# Altium schematic sheet Audio_Output_Line_Out.SchDoc: Audio Research: Line Out
size A4; DrawnBy: Connor Dack; Engineer: Connor Dack; DocumentNumber: 18; Revision: 1.0; SheetNumber: 18; SheetTotal: 20
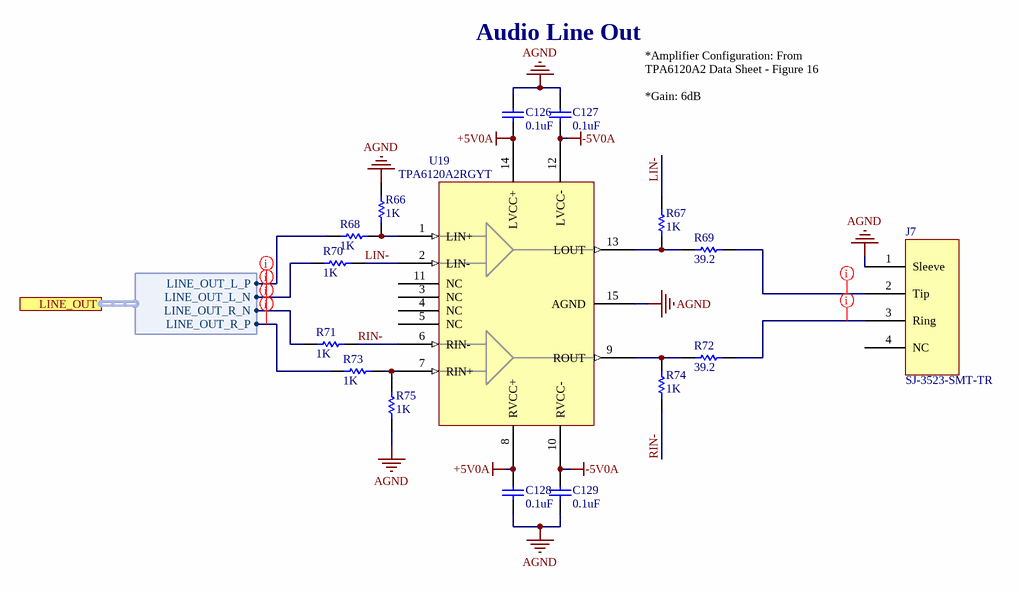
[diagram p0: Audio_Output_Line_Out.SchDoc]

## Parts
C126  Capacitance: 0.1uF  [3-0603_L]  (hidden comment: CL10F104ZO8NNNC)
C127  Capacitance: 0.1uF  [3-0603_L]  (hidden comment: CL10F104ZO8NNNC)
C128  Capacitance: 0.1uF  [3-0603_L]  (hidden comment: CL10F104ZO8NNNC)
C129  Capacitance: 0.1uF  [3-0603_L]  (hidden comment: CL10F104ZO8NNNC)
J7  SJ-3523-SMT-TR  [SJ-3523-SMT-TR]
R66  Resistance (Ohms): 1K  [3-0603_R_L]  (hidden comment: ERJ-3EKF1001V)
R67  Resistance (Ohms): 1K  [3-0603_R_L]  (hidden comment: ERJ-3EKF1001V)
R68  Resistance (Ohms): 1K  [3-0603_R_L]  (hidden comment: ERJ-3EKF1001V)
R69  Resistance (Ohms): 39.2  [3-0603_R_L]  (hidden comment: ERJ-3EKF39R2V)
R70  Resistance (Ohms): 1K  [3-0603_R_L]  (hidden comment: ERJ-3EKF1001V)
R71  Resistance (Ohms): 1K  [3-0603_R_L]  (hidden comment: ERJ-3EKF1001V)
R72  Resistance (Ohms): 39.2  [3-0603_R_L]  (hidden comment: ERJ-3EKF39R2V)
R73  Resistance (Ohms): 1K  [3-0603_R_L]  (hidden comment: ERJ-3EKF1001V)
R74  Resistance (Ohms): 1K  [3-0603_R_L]  (hidden comment: ERJ-3EKF1001V)
R75  Resistance (Ohms): 1K  [3-0603_R_L]  (hidden comment: ERJ-3EKF1001V)
U19  TPA6120A2RGYT  [PQFN50P350X350X100_HS-15N]

## Ports
LINE_OUT (harness LINE_OUT)

## Harnesses
LINE_OUT: LINE_OUT_L_N, LINE_OUT_L_P, LINE_OUT_R_N, LINE_OUT_R_P

## Nets
+5V0A: C126.2 C128.1 U19.8(RVCC+) U19.14(LVCC+)
-5V0A: C127.2 C129.1 U19.10(RVCC-) U19.12(LVCC-)
AGND: C126.1 C127.1 C128.2 C129.2 J7.1(Sleeve) R66.2 R75.1 U19.15(AGND)
LIN-: R67.1 R70.2 U19.2(LIN-)
RIN-: R71.2 R74.2 U19.6(RIN-)
NetJ7_2: J7.2(Tip) R69.2
NetJ7_3: J7.3(Ring) R72.2
NetR66_1: R66.1 R68.2 U19.1(LIN+)
NetR67_2: R67.2 R69.1 U19.13(LOUT)
NetR68_1: R68.1 ; port LINE_OUT.LINE_OUT_L_P
NetR70_1: R70.1 ; port LINE_OUT.LINE_OUT_L_N
NetR71_1: R71.1 ; port LINE_OUT.LINE_OUT_R_N
NetR72_1: R72.1 R74.1 U19.9(ROUT)
NetR73_1: R73.1 ; port LINE_OUT.LINE_OUT_R_P
NetR73_2: R73.2 R75.2 U19.7(RIN+)

Not connected (* = marked no-connect by the designer): J7 4(NC); U19 3(NC) 4(NC) 5(NC) 11(NC)

## Layout directives
net class Line_Out: NetR68_1, NetR70_1, NetR71_1, NetR73_1
net class Line_Out_3.5mm: NetJ7_2, NetJ7_3

## Notes on the sheet
- Audio Line Out
- *Amplifier Configuration: From TPA6120A2 Data Sheet - Figure 16
  *Gain: 6dB
- Title:
- Sheet:
- of
- Size:
- A4
- Rev:
- Date:
- Engineer:
- Time:
- File:

## Library data of the parts
C126-C129 = CL10F104ZO8NNNC: CAP CER 0.1UF 16V Y5V 0603; Manufacturer: Samsung; Tolerance: 80%; Supplier 1: Digi-Key; Stock 1: 40000; Pricing 1: 1=0.1, 10=0.038, 100=0.0169, 500=0.01208, 1000=0.00949 (USD); Mount: Surface Mount; Case/Package: 0603; Case Code (Metric): 1608; Case Code (Imperial): 0603; Min Operating Temperature: -30°C; Max Operating Temperature: 85°C; Package Quantity: 1; Packaging: Tape and Reel; Voltage Rating: 16V; Dielectric: Y5V; Length: 1.6mm; Height: 0.8mm; Width: 0.031inch; Thickness: 0.035inch; Depth: 0.8mm; Radiation Hardening: No; ComponentLink1URL: https://datasheet.ciiva.com/25805/cl10f104zo8nnnc-25805810.pdf; ComponentLink1Description: https://datasheet.ciiva.com/25805/cl10f104zo8nnnc-25805810.pdf; ComponentLink2URL: https://datasheet.ciiva.com/16199/cl10f104zo8nnnc-16199254.pdf; ComponentLink2Description: https://datasheet.ciiva.com/16199/cl10f104zo8nnnc-16199254.pdf; Supplier Part Number 1: 1276-1258-6-ND; Manufacturer Part Number: CL10F104ZO8NNNC
J7 = SJ-3523-SMT-TR: 3.50mm (0.141", 1/8", Mini Plug) - Headphone Phone Jack Stereo Connector Solder; Manufacturer: CUI Inc.; Gender: Female; Actual Diameter: 0.142" (3.60mm); Number of Positions/Contacts: 3 Conductors, 3 Contacts; Internal Switch(s): Does Not Contain Switch; Shielding: Unshielded; Voltage - Rated: 12VDC; Current Rating: 1A; Mating Length/Depth: 0.551" (14.00mm); Body Color: Black; Includes: 1 pc - 1 Connector; Notes: FE Provides: 23; LatestRevisionDate: 17-Jul-2002; LatestRevisionNote: Re-released for DXP Platform.; Publisher: Altium Limited; Supplier 1: Digi-Key; RoHS: RoHS Compliant; Category: Connectors, Interconnects; Stock 1: 104981; Pricing 1: 1=1.34, 10=1.043, 100=0.7961, 500=0.63558 (USD); Packaging: Cut Tape (CT); Part Status: Active; Connector Type: Phone Jack; Signal Lines: Stereo; Industry Recognized Mating Diameter: 3.50mm (0.141", 1/8", Mini Plug) - Headphone; Mounting Type: Surface Mount, Right Angle; Termination: Solder; Features: Board Guide; Insulation Color: -; Contact Material - Plating: Silver; Body Material: -; ComponentLink1URL: http://www.cui.com/product/resource/digikeypdf/sj-352x-smt_series.pdf; ComponentLink1Description: http://www.cui.com/product/resource/digikeypdf/sj-352x-smt_series.pdf; Supplier Part Number 1: CP-3523SJCT-ND; Manufacturer Part Number: SJ-3523-SMT-TR
R66-R68 R70 R71 R73-R75 = ERJ-3EKF1001V: RES 1.00K OHM 1/10W 1% 0603 SMD; Manufacturer: Panasonic - ECG; Power (Watts): 0.1W, 1/10W; Temperature Coefficient: ±100ppm/°C; Supplier 1: Digi-Key; Manufacturer Part Number: ERJ-3EKF1001V; RoHS: RoHS Compliant; Category: Resistors; Stock 1: 5088743; Pricing 1: 1=0.04, 50=0.0138, 100=0.0105, 250=0.0078, 500=0.00576, 1000=0.00384 (USD); Composition: Thick Film; Features: -; Tolerance: ±1%; Package / Case: 0603 (1608 Metric); Size / Dimension: 0.063" L x 0.031" W (1.60mm x 0.80mm); Height: 0.022" (0.55mm); Number of Terminations: 2; Packaging: Cut Tape (CT); ComponentLink1URL: http://industrial.panasonic.com/www-cgi/jvcr13pz.cgi?E+PZ+3+AOA0002+ERJ3EKF1001V+7+WW; ComponentLink1Description: http://industrial.panasonic.com/www-cgi/jvcr13pz.cgi?E+PZ+3+AOA0002+ERJ3EKF1001V+7+WW; Supplier Part Number 1: P1.00KHCT-ND
R69 R72 = ERJ-3EKF39R2V: n RES SMD 39.2 OHM 1% 1/10W 0603; Manufacturer: Panasonic Electronic Components; Power (Watts): 0.1W, 1/10W; Temperature Coefficient: ±100ppm/°C; Supplier 1: Digi-Key; Manufacturer Part Number: ERJ-3EKF39R2V; RoHS: RoHS Compliant; Category: Resistors; Stock 1: 34148; Pricing 1: 1=0.1, 50=0.0114, 100=0.0084, 250=0.00644, 500=0.00514, 1000=0.00379 (USD); Packaging: Cut Tape (CT); Part Status: Active; Tolerance: ±1%; Composition: Thick Film; Features: Automotive AEC-Q200; Operating Temperature: -55°C ~ 155°C; Package / Case: 0603 (1608 Metric); Supplier Device Package: 0603; Size / Dimension: 0.063" L x 0.031" W (1.60mm x 0.80mm); Height: 0.022" (0.55mm); Number of Terminations: 2; ComponentLink1URL: http://industrial.panasonic.com/www-cgi/jvcr13pz.cgi?E+PZ+3+AOA0002+ERJ3EKF39R2V+7+WW; ComponentLink1Description: http://industrial.panasonic.com/www-cgi/jvcr13pz.cgi?E+PZ+3+AOA0002+ERJ3EKF39R2V+7+WW; Supplier Part Number 1: P39.2HCT-ND
U19 = TPA6120A2RGYT: Amplifier IC Headphones, 2-Channel (Stereo) Class AB 14-VQFN (3.5x3.5); Manufacturer: Texas Instruments; Max Output Power x Channels @ Load: 80mW x 2 @ 600 Ohm; Voltage - Supply: 10 V ~ 30 V, ±5 V ~ 15 V; LatestRevisionDate: 17-Jul-2002; LatestRevisionNote: Re-released for DXP Platform.; Publisher: Altium Limited; Supplier 1: Digi-Key; RoHS: RoHS Compliant; Category: Integrated Circuits (ICs); Stock 1: 867; Pricing 1: 1=6.04, 10=5.424, 100=4.4501 (USD); Packaging: Cut Tape (CT); Part Status: Active; Type: Class AB; Output Type: Headphones, 2-Channel (Stereo); Features: Differential Inputs, Short-Circuit and Thermal Protection; Mounting Type: Surface Mount; Operating Temperature: -40°C ~ 85°C (TA); Supplier Device Package: 14-VQFN (3.5x3.5); Package / Case: 14-VFQFN Exposed Pad; ComponentLink1URL: http://www.ti.com/lit/ds/symlink/tpa6120a2.pdf; ComponentLink1Description: http://www.ti.com/lit/ds/symlink/tpa6120a2.pdf; Supplier Part Number 1: 296-38029-1-ND; Manufacturer Part Number: TPA6120A2RGYT